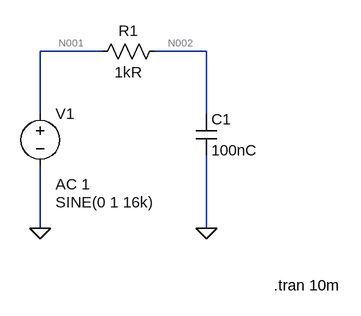
[diagram p0: schematic Draft5.asc]
Draft5.asc, the LTspice schematic file:
Version 4.1
SHEET 1 880 680
WIRE 128 64 32 64
WIRE 288 64 208 64
WIRE 32 160 32 64
WIRE 288 160 288 64
WIRE 32 336 32 240
WIRE 288 336 288 224
FLAG 32 336 0
FLAG 288 336 0
SYMBOL voltage 32 144 R0
WINDOW 3 24 152 Left 2
WINDOW 123 24 124 Left 2
WINDOW 39 0 0 Left 0
SYMATTR InstName V1
SYMATTR Value SINE(0 1 16k)
SYMATTR Value2 AC 1
SYMBOL res 224 48 R90
WINDOW 0 0 56 VBottom 2
WINDOW 3 32 56 VTop 2
SYMATTR InstName R1
SYMATTR Value 1kR
SYMBOL cap 272 160 R0
SYMATTR InstName C1
SYMATTR Value 100nC
TEXT 392 424 Left 2 !.tran 10m

The netlist it stands for:
* Draft5.asc
V1 N001 0 SINE(0 1 16k) AC 1
R1 N002 N001 1kR
C1 N002 0 100nC
.tran 10m
.backanno
.end

* Results of the author's LTspice run, read from the files saved beside the schematic
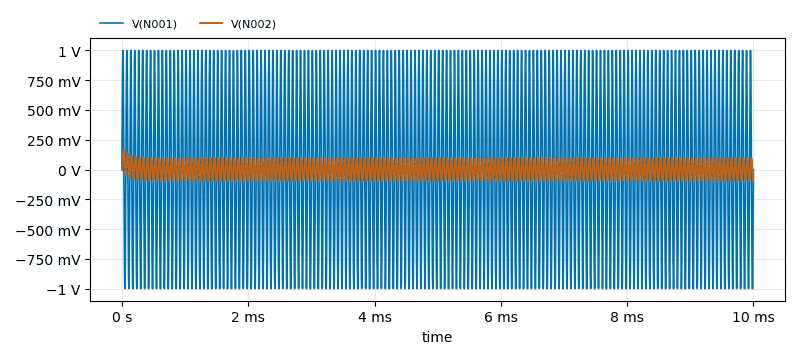
[diagram p1: Transient Analysis of Draft5.asc, plotted from the saved traces]
* Transient Analysis, 1 run:
*   V(N001): min -1 V, max 1 V, average 10.09 µV, rms 717.5 mV, last 0 V
*   V(N002): min -97.22 mV, max 169.2 mV, average 977.7 µV, rms 68.38 mV, last -96.76 mV